# EAGLE design LampBoard (EAGLE 7.5.0)
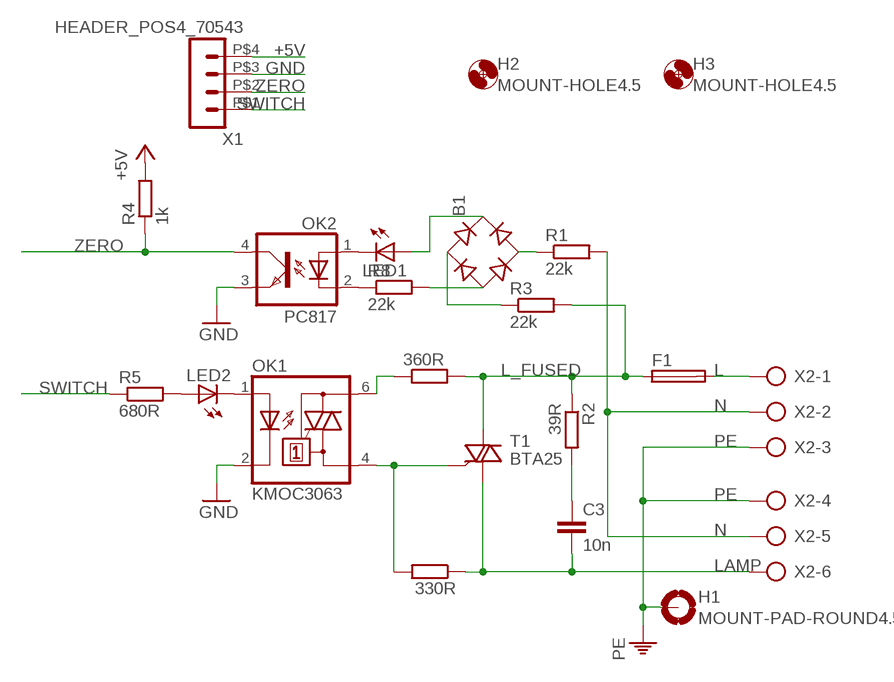
[diagram p0: schematic, sheet 1]

## Parts
330R  R-EU_0411/12  [0411/12]
360R  R-EU_0411/12  [0411/12]
B1  B-DIL  [B-DIL]
C3  10n  C-EU050-045X075  [C050-045X075]
F1  SH22,5A  [SH22,5A]
H1  MOUNT-PAD-ROUND4.5  [4,5-PAD]
H2  MOUNT-HOLE4.5  [4,5]
H3  MOUNT-HOLE4.5  [4,5]
LED1  LED3MM  [LED3MM]
LED2  LED3MM  [LED3MM]
OK1  KMOC3063  MOC3041M  [DIL06]
OK2  PC817  [DIL04]
R1  22k  R-EU_0207/10  [0207/10]
R2  39R  R-EU_0411/12  [0411/12]
R3  22k  R-EU_0207/10  [0207/10]
R4  1k  R-EU_M0805  [M0805]
R5  680R  R-EU_M0805  [M0805]
R8  22k  R-EU_0207/10  [0207/10]
T1  BTA25  BT138-V  [TO220BV]
X1  HEADER_POS4_70543  [70543-POS4]
X2  AK300/6  [AK300/6]

## Nets
22K: B1.AC2 R1.1
+5V: R4.2 X1.P$4
GND: OK1.2(C) OK2.3(EMIT) X1.P$3
L: F1.2 X2.1
L_FUSED: 360R.2 F1.1 R2.1 R3.2 T1.T2(A2)
LAMP: 330R.1 C3.2 T1.T1(A1) X2.6
N: R1.2 X2.2 X2.5
N$1: C3.1 R2.2
N$2: 360R.1 OK1.6(A2)
N$3: 330R.2 OK1.4(A1) T1.G
N$4: LED1.K(C) OK2.1(A)
N$5: B1.AC1 R3.1
N$6: LED2.K(C) OK1.1(A)
N$7: OK2.2(C) R8.1
N$8: B1.+ LED1.A
N$9: LED2.A R5.2
N$11: B1.- R8.2
PE: H1.B4,5(MOUNT) X2.3 X2.4
SWITCH: R5.1 X1.P$1
ZERO: OK2.4(COL) R4.1 X1.P$2

## Library data of the parts
330R 360R R1-R5 R8 = rcl:R-EU_: RESISTOR, European symbol
B1 = rectifier:B-DIL: RECTIFIER
C3 = rcl:C-EU: CAPACITOR, European symbol
F1 = fuse:SH22,5A: FUSE HOLDER grid 22,5mm, isolated cap OGN0031 8201, Schurter (Buerklin); MPN: 0031.7701.11; OC_FARNELL: unknown; OC_NEWARK: 04F1224
H1 = holes:MOUNT-PAD-ROUND: MOUNTING PAD, round
H2 H3 = holes:MOUNT-HOLE: MOUNTING HOLE with drill center marker
LED1 LED2 = led:LED: LED OSRAM: - CHIPLED LG R971, LG N971, LY N971, LG Q971, LY Q971, LO R971, LY R971 LH N974, LH R974 LS Q976, LO Q976, LY Q976 LO Q996 - Hyper CHIPLED LW Q18S LB Q993, LB Q99A, LB R99A - SideLED LS A670, LO A670, LY A670, LG A670, LP A670 LB A673, LV A673, LT A673, LW A673 LH A674 LY A675 LS A676, LA A676, LO A676, LY A676, LW A676 LS A679, LY A679, LG A679 - Hyper Micro SIDELED® LS Y876, LA Y876, LO Y876, LY Y876 LT Y87S - SmartLED LW L88C, LW L88S LB L89C, LB L89S, LG L890 LS L89K, LO L89K, LY L89K LS L896, LA L896, LO L896, LY L896 - TOPLED LS T670, LO T670, LY T670, LG T670, LP T670 LSG T670, LSP T670, LSY T670, LOP T670, LYG T670 LG T671, LOG T671, LSG T671 LB T673, LV T673, LT T673, LW T673 LH T674 LS T676, LA T676, LO T676, LY T676, LB T676, LH T676, LSB T676, LW T676 LB T67C, LV T67C, LT T67C, LS T67K, LO T67K, LY T67K, LW E67C LS E67B, LA E67B, LO E67B, LY E67B, LB E67C, LV E67C, LT E67C LW T67C LS T679, LY T679, LG T679 LS T770, LO T770, LY T770, LG T770, LP T770 LB T773, LV T773, LT T773, LW T773 LH T774 LS E675, LA E675, LY E675, LS T675 LS T776, LA T776, LO T776, LY T776, LB T776 LHGB T686 LT T68C, LB T68C - Hyper Mini TOPLED® LB M676 - Mini TOPLED Santana® LG M470 LS M47K, LO M47K, LY M47K Source: http://www.osram.convergy.de LUXEON: - LUMILED® LXK2-PW12-R00, LXK2-PW12-S00, LXK2-PW14-U00, LXK2-PW14-V00 LXK2-PM12-R00, LXK2-PM12-S00, LXK2-PM14-U00 LXK2-PE12-Q00, LXK2-PE12-R00, LXK2-PE12-S00, LXK2-PE14-T00, LXK2-PE14-U00 LXK2-PB12-K00, LXK2-PB12-L00, LXK2-PB12-M00, LXK2-PB14-N00, LXK2-PB14-P00, LXK2-PB14-Q00 LXK2-PR12-L00, LXK2-PR12-M00, LXK2-PR14-Q00, LXK2-PR14-R00 LXK2-PD12-Q00, LXK2-PD12-R00, LXK2-PD12-S00 LXK2-PH12-R00, LXK2-PH12-S00 LXK2-PL12-P00, LXK2-PL12-Q00, LXK2-PL12-R00 Source: www.luxeon.com KINGBRIGHT: KA-3528ASYC Source: www.kingbright.com
OK1 = optocoupler:MOC30*: 6-Pin DIP Zero-Cross Optoisolators Triac Driver Output (250/400 Volt Peak) Source: Data sheet <http://www.fairchildsemi.com/ds/MO/MOC3031M.pdf> The old path of data sheet not more available 2013-05-06.; MF: FAIRCHILD SEMICONDUCTOR; MPN: MOC3041M; OC_FARNELL: 1086677; OC_NEWARK: 78K6090
OK2 = optocoupler:PC817: SHARP OPTO COUPLER; MPN: PC817X4J000F; OC_FARNELL: 9707727; OC_NEWARK: 97K7059
T1 = triac:BT138: TRIAC Source: http://www.semiconductors.philips.com BT138_SERIES_2.pdf
X1 = con-molex-c-grid-sl:HEADER_POS4_?: Molex -C-Grid® / SL Series connector Wire-to-Board 2.54 mm (0.100") pitch header, 4 positions.
X2 = con-ptr500:AK300/6: CONNECTOR; OC_FARNELL: unknown; OC_NEWARK: unknown

## Board
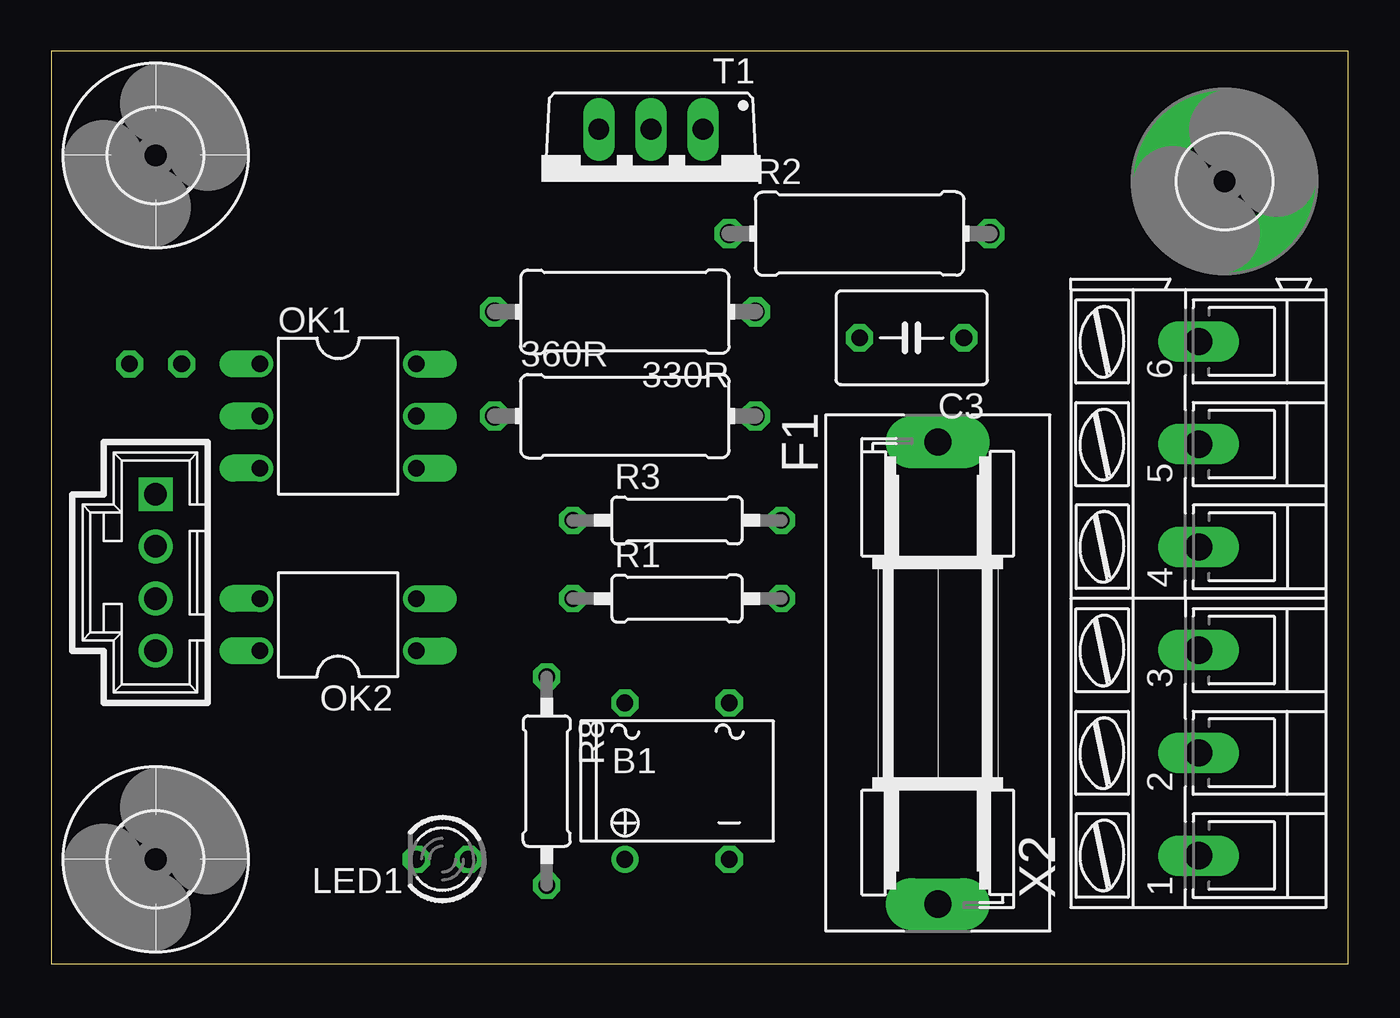
[diagram p1: board, top side]
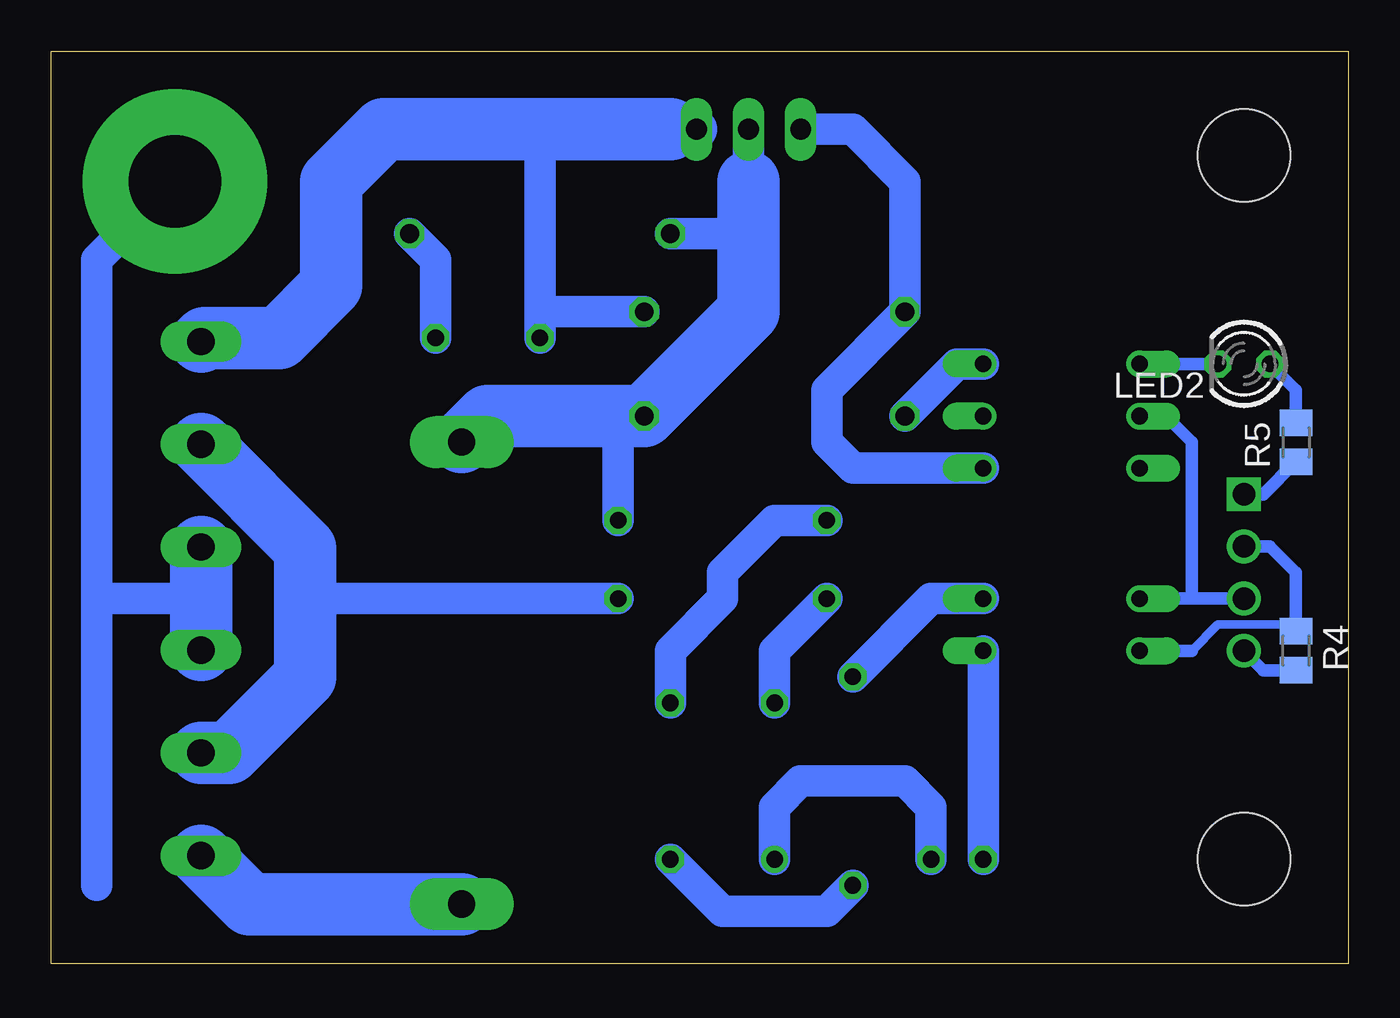
[diagram p2: board, bottom side, seen from below]

Size 63.17 x 44.44 mm. Coordinates in mm from the lower left corner, seen from the top.
Outline: 0,0 63.17,0 63.17,44.44 0,44.44 0,0
Copper layers (1*16): Top 0.035mm / dielectric 1.5mm / Bottom 0.035mm
Design rules "default": minimum track width 10mil, minimum drill 24mil, track to track 8mil, track to pad 8mil, pad to pad 8mil, via to via 8mil, smd to smd 8mil, copper to edge 40mil, drill to drill 8mil, minimum pad ring 10mil, minimum via ring 8mil, stop-mask expansion 4mil, vias tented up to drill 0mil, thermal gap 10mil

### Footprints (pad centres in the part's own frame; a part is rotated, then mirrored left to right if it is on the bottom)
0411/12 = drill 0.914 octagon: 1 -6.35,0; 2 6.35,0
B-DIL = drill 0.813: + -2.54,-3.81 | drill 0.813 octagon: - 2.54,-3.81; AC1 2.54,3.81; AC2 -2.54,3.81
C050-045X075 = drill 0.813 octagon: 1 -2.54,0; 2 2.54,0
SH22,5A = drill 1.321 pad 2.54 long: 1 -11.252,0; 2 11.252,0
4,5-PAD = drill 4.5 pad 9: B4,5 0,0
4,5 = hole 4.5: 0,0
LED3MM = drill 0.813 octagon: A -1.27,0; K 1.27,0
DIL06 = drill 0.813 offset: 1 -2.54,-3.81; 2 0,-3.81; 3 2.54,-3.81; 4 2.54,3.81; 5 0,3.81; 6 -2.54,3.81
DIL04 = drill 0.813 offset: 1 -1.27,-3.81; 2 1.27,-3.81; 3 1.27,3.81; 4 -1.27,3.81
0207/10 = drill 0.813 octagon: 1 -5.08,0; 2 5.08,0
M0805 = smd 1.3 x 1.6: 1 -0.95,0; 2 0.95,0
TO220BV = drill 1.016 long: G 2.54,-2.54; T1 -2.54,-2.54; T2 0,-2.54
70543-POS4 = drill 1.1 square: P$1 3.81,0 | drill 1.1: P$2 1.27,0; P$3 -1.27,0; P$4 -3.81,0
AK300/6 = drill 1.321 long: 1 -12.522,0; 2 -7.518,0; 3 -2.515,0; 4 2.515,0; 5 7.518,0; 6 12.522,0

### Placement (x,y rotation side)
330R  27.94,31.75 180 top
360R  27.94,26.67 0 top
B1  30.48,8.89 0 top
C3  41.91,30.48 180 top
F1  43.18,14.15 270 top
H1  57.15,38.1 0 top
H2  5.08,39.37 0 top
H3  5.08,5.08 0 top
LED1  19.05,5.08 180 top
LED2  5.08,29.21 180 bottom
OK1  13.97,26.67 270 top
OK2  13.97,16.51 90 top
R1  30.48,17.78 0 top
R2  39.37,35.56 0 top
R3  30.48,21.59 0 top
R4  2.54,15.24 270 bottom
R5  2.54,25.4 90 bottom
R8  24.13,8.89 270 top
T1  29.21,38.1 180 top
X1  5.08,19.05 90 top
X2  55.88,17.78 90 top

### Tracks (layer width: path | path; a pad name or v marks a point on that pad's centre or on a via)
22K
  Bottom 1.524: B1.AC2 27.94,15.24 R1.1
+5V
  Bottom 0.61: R4.2 4.13,14.29 X1.P$4
GND
  Bottom 0.61: X1.P$3 7.62,17.78 | OK2.3 7.62,17.78 | 7.62,17.78 7.62,25.4 8.89,26.67 OK1.2
L
  Bottom 3.048: F1.2 53.52,2.9 X2.1
L_FUSED
  Bottom 1.524: R2.1 29.21,35.56 | R3.2 35.56,26.67 | 29.21,38.1 T1.T2
  Bottom 3.048: F1.1 41.91,26.67 35.56,26.67 360R.2 29.21,31.75 29.21,35.56 29.21,38.1
LAMP
  Bottom 1.524: 330R.1 39.37,31.75 | 39.37,31.75 39.37,40.64 | C3.2 39.37,31.75
  Bottom 2.032: T1.T1 33.02,40.64
  Bottom 3.048: 33.02,40.64 39.37,40.64 46.99,40.64 49.53,38.1 49.53,33.02 52.07,30.48 55.7,30.48 X2.6
N
  Bottom 1.524: R1.2 50.8,17.78
  Bottom 3.048: X2.2 54.51,10.26 50.8,13.97 50.8,17.78 50.8,20.22 X2.5
N$1
  Bottom 1.524: C3.1 44.45,34.29 R2.2
N$2
  Bottom 1.524: OK1.6 19.05,29.21 360R.1
N$3
  Bottom 1.524: T1.G 24.13,40.64 21.59,38.1 330R.2 25.4,27.94 25.4,25.4 24.13,24.13 OK1.4
N$4
  Bottom 1.524: LED1.K OK2.1
N$5
  Bottom 1.524: B1.AC1 33.02,15.24 30.48,17.78 30.48,19.05 27.94,21.59 R3.1
N$6
  Bottom 0.61: LED2.K OK1.1
N$7
  Bottom 1.524: OK2.2 20.32,17.78 R8.1
N$8
  Bottom 1.524: B1.+ 27.94,7.62 26.67,8.89 21.59,8.89 20.32,7.62 LED1.A
N$9
  Bottom 0.61: R5.2 2.54,27.94 LED2.A
N$11
  Bottom 1.524: R8.2 25.4,2.54 30.48,2.54 B1.-
PE
  Bottom 1.524: H1.B4,5 60.96,34.29 60.96,17.78 | 60.96,17.78 55.88,17.78 | 60.96,17.78 60.96,3.81
  Bottom 3.048: X2.4 55.88,17.78 X2.3
SWITCH
  Bottom 0.61: X1.P$1 4.13,22.86 R5.1
ZERO
  Bottom 0.406: 7.62,15.24 6.35,16.51 2.86,16.51 R4.1
  Bottom 0.61: X1.P$2 3.81,20.32 2.54,19.05 R4.1 | OK2.4 7.62,15.24